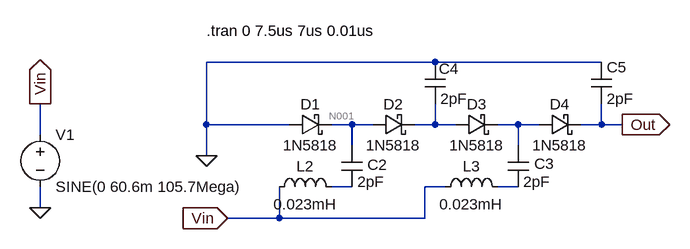
[diagram p0: schematic Dickson_voltage_multiplier.asc]
Dickson_voltage_multiplier.asc, the LTspice schematic file:
Version 4
SHEET 1 880 680
WIRE 176 32 -176 32
WIRE 432 32 176 32
WIRE -176 128 -176 32
WIRE -48 128 -176 128
WIRE 48 128 16 128
WIRE 80 128 48 128
WIRE 176 128 176 96
WIRE 176 128 144 128
WIRE 208 128 176 128
WIRE 304 128 272 128
WIRE 336 128 304 128
WIRE 432 128 432 96
WIRE 432 128 400 128
WIRE 464 128 432 128
WIRE -432 144 -432 96
WIRE 48 160 48 128
WIRE 304 160 304 128
WIRE -176 176 -176 128
WIRE 48 224 16 224
WIRE 192 224 160 224
WIRE 304 224 272 224
WIRE -432 256 -432 224
WIRE -64 272 -64 224
WIRE -64 272 -144 272
WIRE 160 272 160 224
WIRE 160 272 -64 272
FLAG -176 176 0
FLAG -144 272 Vin
IOPIN -144 272 In
FLAG 464 128 Out
IOPIN 464 128 Out
FLAG -432 256 0
FLAG -432 96 Vin
IOPIN -432 96 Out
SYMBOL schottky 80 112 M90
WINDOW 0 0 32 VBottom 2
WINDOW 3 32 32 VTop 2
SYMATTR InstName D2
SYMATTR Value 1N5818
SYMATTR Description Diode
SYMATTR Type diode
SYMBOL cap 32 160 R0
WINDOW 0 40 30 Left 2
SYMATTR InstName C2
SYMATTR Value 2pF
SYMBOL cap 160 32 R0
WINDOW 0 22 10 Left 2
SYMATTR InstName C4
SYMATTR Value 2pF
SYMBOL cap 288 160 R0
WINDOW 0 41 28 Left 2
SYMATTR InstName C3
SYMATTR Value 2pF
SYMBOL cap 416 32 R0
SYMATTR InstName C5
SYMATTR Value 2pF
SYMBOL ind -80 240 R270
WINDOW 0 32 56 VTop 2
WINDOW 3 5 56 VBottom 2
SYMATTR InstName L2
SYMATTR Value 0.023mH
SYMBOL ind 176 240 R270
WINDOW 0 32 56 VTop 2
WINDOW 3 5 56 VBottom 2
SYMATTR InstName L3
SYMATTR Value 0.023mH
SYMBOL voltage -432 128 R0
WINDOW 123 0 0 Left 2
WINDOW 39 0 0 Left 2
SYMATTR InstName V1
SYMATTR Value SINE(0 60.6m 105.7Mega)
SYMBOL schottky -48 112 M90
WINDOW 0 0 32 VBottom 2
WINDOW 3 32 32 VTop 2
SYMATTR InstName D1
SYMATTR Value 1N5818
SYMATTR Description Diode
SYMATTR Type diode
SYMBOL schottky 208 112 M90
WINDOW 0 0 32 VBottom 2
WINDOW 3 32 32 VTop 2
SYMATTR InstName D3
SYMATTR Value 1N5818
SYMATTR Description Diode
SYMATTR Type diode
SYMBOL schottky 336 112 M90
WINDOW 0 0 32 VBottom 2
WINDOW 3 32 32 VTop 2
SYMATTR InstName D4
SYMATTR Value 1N5818
SYMATTR Description Diode
SYMATTR Type diode
TEXT -176 -16 Left 2 !.tran 0 7.5us 7us 0.01us

The netlist it stands for:
* Dickson_voltage_multiplier.asc
D2 N001 N002 1N5818
C2 N001 N004 2pF
C4 0 N002 2pF
C3 N003 N005 2pF
C5 0 Out 2pF
L2 Vin N004 0.023mH
L3 Vin N005 0.023mH
V1 Vin 0 SINE(0 60.6m 105.7Mega)
D1 0 N001 1N5818
D3 N002 N003 1N5818
D4 N003 Out 1N5818
.model D D
.lib standard.dio
.tran 0 7.5us 7us 0.01us
.backanno
.end

* Results of the author's LTspice run, read from the files saved beside the schematic
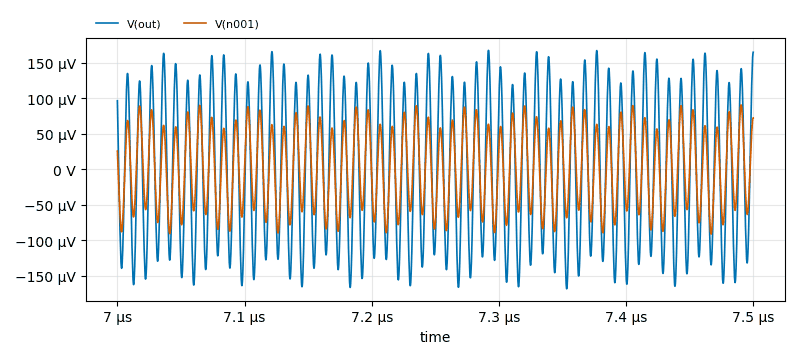
[diagram p1: Transient Analysis of Dickson_voltage_multiplier.asc, plotted from the saved traces]
* Transient Analysis, 1 run:
*   V(out): min -168.7 µV, max 167.7 µV, average -534.1 nV, rms 102.2 µV, last 165 µV
*   V(n001): min -91.52 µV, max 90.63 µV, average 134 nV, rms 53.08 µV, last 72.27 µV